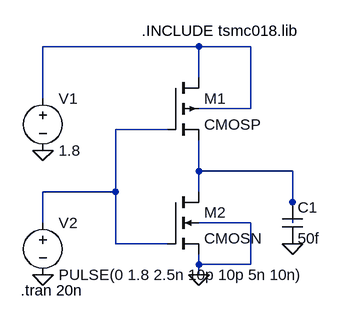
[diagram p0: schematic Exp-1 transient.asc]
Exp-1 transient.asc, the LTspice schematic file:
Version 4
SHEET 1 880 680
WIRE 128 64 -112 64
WIRE 208 64 128 64
WIRE 128 112 128 64
WIRE -112 144 -112 64
WIRE 208 160 208 64
WIRE 208 160 128 160
WIRE 80 192 0 192
WIRE 128 256 128 208
WIRE 272 256 128 256
WIRE 0 288 0 192
WIRE 0 288 -112 288
WIRE 128 288 128 256
WIRE 272 304 272 256
WIRE -112 336 -112 288
WIRE 208 336 128 336
WIRE 272 336 272 304
WIRE 0 368 0 288
WIRE 80 368 0 368
WIRE 128 400 128 384
WIRE 208 400 208 336
WIRE 208 400 128 400
WIRE 128 416 128 400
FLAG -112 224 0
FLAG -112 416 0
FLAG 128 416 0
FLAG 272 368 0
SYMBOL cmosp 80 112 R0
SYMATTR InstName M1
SYMATTR Value2 l=180n w=800n
SYMBOL cmosn 80 288 R0
SYMATTR InstName M2
SYMATTR Value2 l=180n w=400n
SYMBOL voltage -112 128 R0
WINDOW 123 0 0 Left 0
WINDOW 39 0 0 Left 0
SYMATTR InstName V1
SYMATTR Value 1.8
SYMBOL voltage -112 320 R0
WINDOW 123 0 0 Left 0
WINDOW 39 0 0 Left 0
SYMATTR InstName V2
SYMATTR Value PULSE(0 1.8 2.5n 10p 10p 5n 10n)
SYMBOL cap 256 304 R0
SYMATTR InstName C1
SYMATTR Value 50f
TEXT 40 40 Left 2 !.INCLUDE tsmc018.lib
TEXT -146 440 Left 2 !.tran 20n

The netlist it stands for:
* Exp-1 transient.asc
M1 N001 N002 N003 N001 CMOSP l=180n w=800n
M2 N003 N002 0 0 CMOSN l=180n w=400n
V1 N001 0 1.8
V2 N002 0 PULSE(0 1.8 2.5n 10p 10p 5n 10n)
C1 N003 0 50f
.model NMOS NMOS
.model PMOS PMOS
.lib standard.mos
.INCLUDE tsmc018.lib
.tran 20n
.backanno
.end